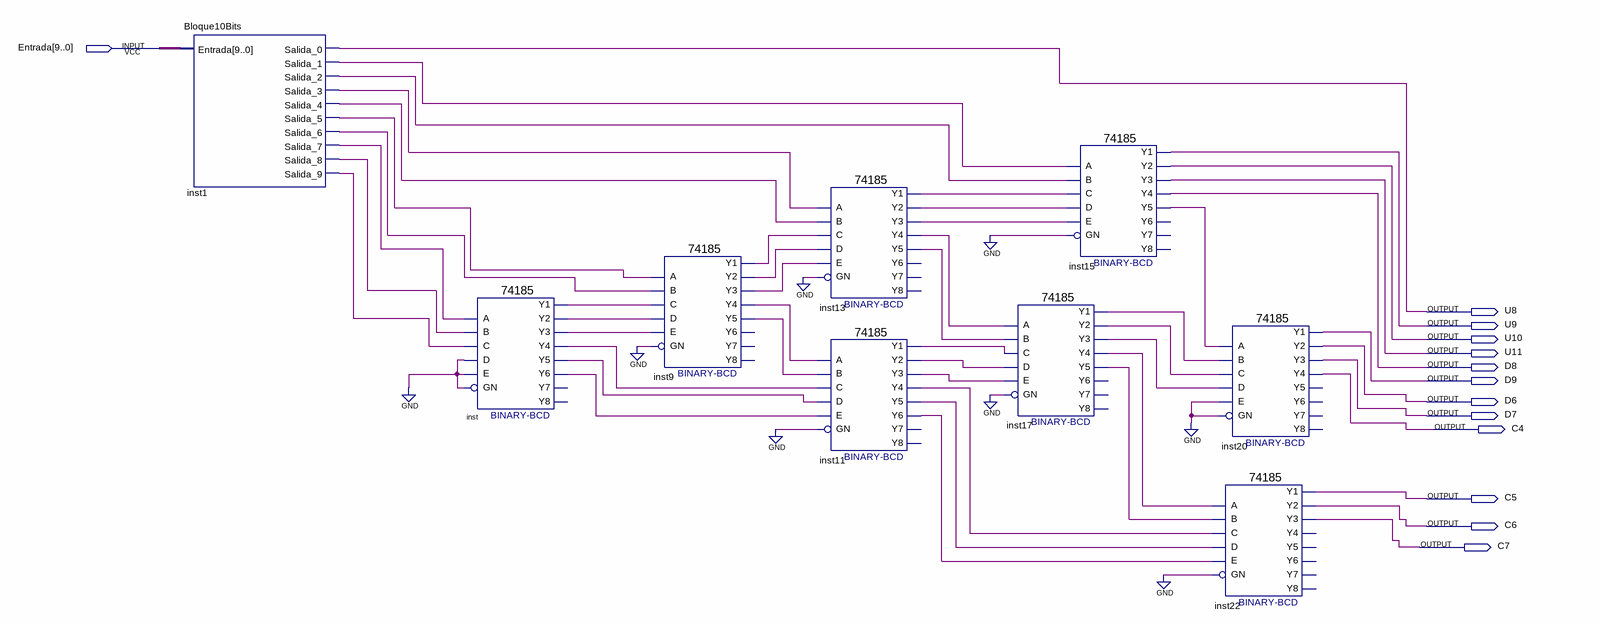
[diagram p0: schematic sheet]
// Quartus schematic Display.bdf as structural Verilog: 9 symbols, 13 pins
module Display (
  input  [9:0] Entrada,
  output U8,
  output U9,
  output U10,
  output U11,
  output D8,
  output D9,
  output D6,
  output D7,
  output C4,
  output C5,
  output C6,
  output C7
);

  wire inst1_salida_7, inst1_salida_8, inst1_salida_9, inst9_y1, inst9_y2, inst9_y3, inst9_y4, inst9_y5,
       inst11_y1, inst11_y2, inst11_y3, inst11_y4, inst11_y5, inst11_y6, inst13_y1, inst13_y2, inst13_y3,
       inst13_y4, inst13_y5, inst15_y5, inst17_y1, inst17_y2, inst17_y3, inst17_y4, inst17_y5, inst_y1,
       inst_y2, inst_y3, inst_y4, inst_y5, inst_y6;
  wire [6:1] B;

  Bloque10Bits inst1 (
    .Entrada(Entrada), .Salida_0(U8), .Salida_1(B[1]), .Salida_2(B[2]), .Salida_3(B[3]), .Salida_4(B[4]),
    .Salida_5(B[5]), .Salida_6(B[6]), .Salida_7(inst1_salida_7), .Salida_8(inst1_salida_8),
    .Salida_9(inst1_salida_9));
  \74185  inst (
    .A(inst1_salida_7), .B(inst1_salida_8), .D(1'b0), .C(inst1_salida_9), .E(1'b0), .GN(1'b0), .Y1(inst_y1),
    .Y3(inst_y3), .Y2(inst_y2), .Y5(inst_y5), .Y4(inst_y4), .Y6(inst_y6));  // open: Y8, Y7
  \74185  inst9 (
    .A(B[5]), .B(B[6]), .D(inst_y2), .C(inst_y1), .E(inst_y3), .GN(1'b0), .Y1(inst9_y1), .Y3(inst9_y3),
    .Y2(inst9_y2), .Y5(inst9_y5), .Y4(inst9_y4));  // open: Y6, Y8, Y7
  \74185  inst13 (
    .A(B[3]), .B(B[4]), .D(inst9_y2), .C(inst9_y1), .E(inst9_y3), .GN(1'b0), .Y1(inst13_y1), .Y3(inst13_y3),
    .Y2(inst13_y2), .Y5(inst13_y5), .Y4(inst13_y4));  // open: Y6, Y8, Y7
  \74185  inst11 (
    .A(inst9_y4), .B(inst9_y5), .D(inst_y5), .C(inst_y4), .E(inst_y6), .GN(1'b0), .Y1(inst11_y1),
    .Y3(inst11_y3), .Y2(inst11_y2), .Y5(inst11_y5), .Y4(inst11_y4), .Y6(inst11_y6));  // open: Y8, Y7
  \74185  inst17 (
    .A(inst13_y4), .B(inst13_y5), .D(inst11_y2), .C(inst11_y1), .E(inst11_y3), .GN(1'b0), .Y1(inst17_y1),
    .Y3(inst17_y3), .Y2(inst17_y2), .Y5(inst17_y5), .Y4(inst17_y4));  // open: Y6, Y8, Y7
  \74185  inst15 (
    .A(B[1]), .B(B[2]), .D(inst13_y2), .C(inst13_y1), .E(inst13_y3), .GN(1'b0), .Y1(U9), .Y3(U11), .Y2(U10),
    .Y5(inst15_y5), .Y4(D8));  // open: Y6, Y8, Y7
  \74185  inst20 (
    .A(inst15_y5), .B(inst17_y1), .D(inst17_y3), .C(inst17_y2), .E(1'b0), .GN(1'b0), .Y1(D9), .Y3(D7),
    .Y2(D6), .Y4(C4));  // open: Y5, Y6, Y8, Y7
  \74185  inst22 (
    .A(inst17_y4), .B(inst17_y5), .D(inst11_y5), .C(inst11_y4), .E(inst11_y6), .GN(1'b0), .Y1(C5), .Y3(C7),
    .Y2(C6));  // open: Y5, Y4, Y6, Y8, Y7

  // Other names for the same wires on the sheet: B[0] = U8
endmodule
